# EasyEDA Pro project Schematic.epro

# Schematic Schematic
Board Name: Project; Create Date: 2025-06-19; Page Name: P1; Project Name: self_contained_light_module; Schematic Name: Schematic; Update Date: 2025-06-20; Company: EasyEDA.com; Page Size: A2; Version: V1.0
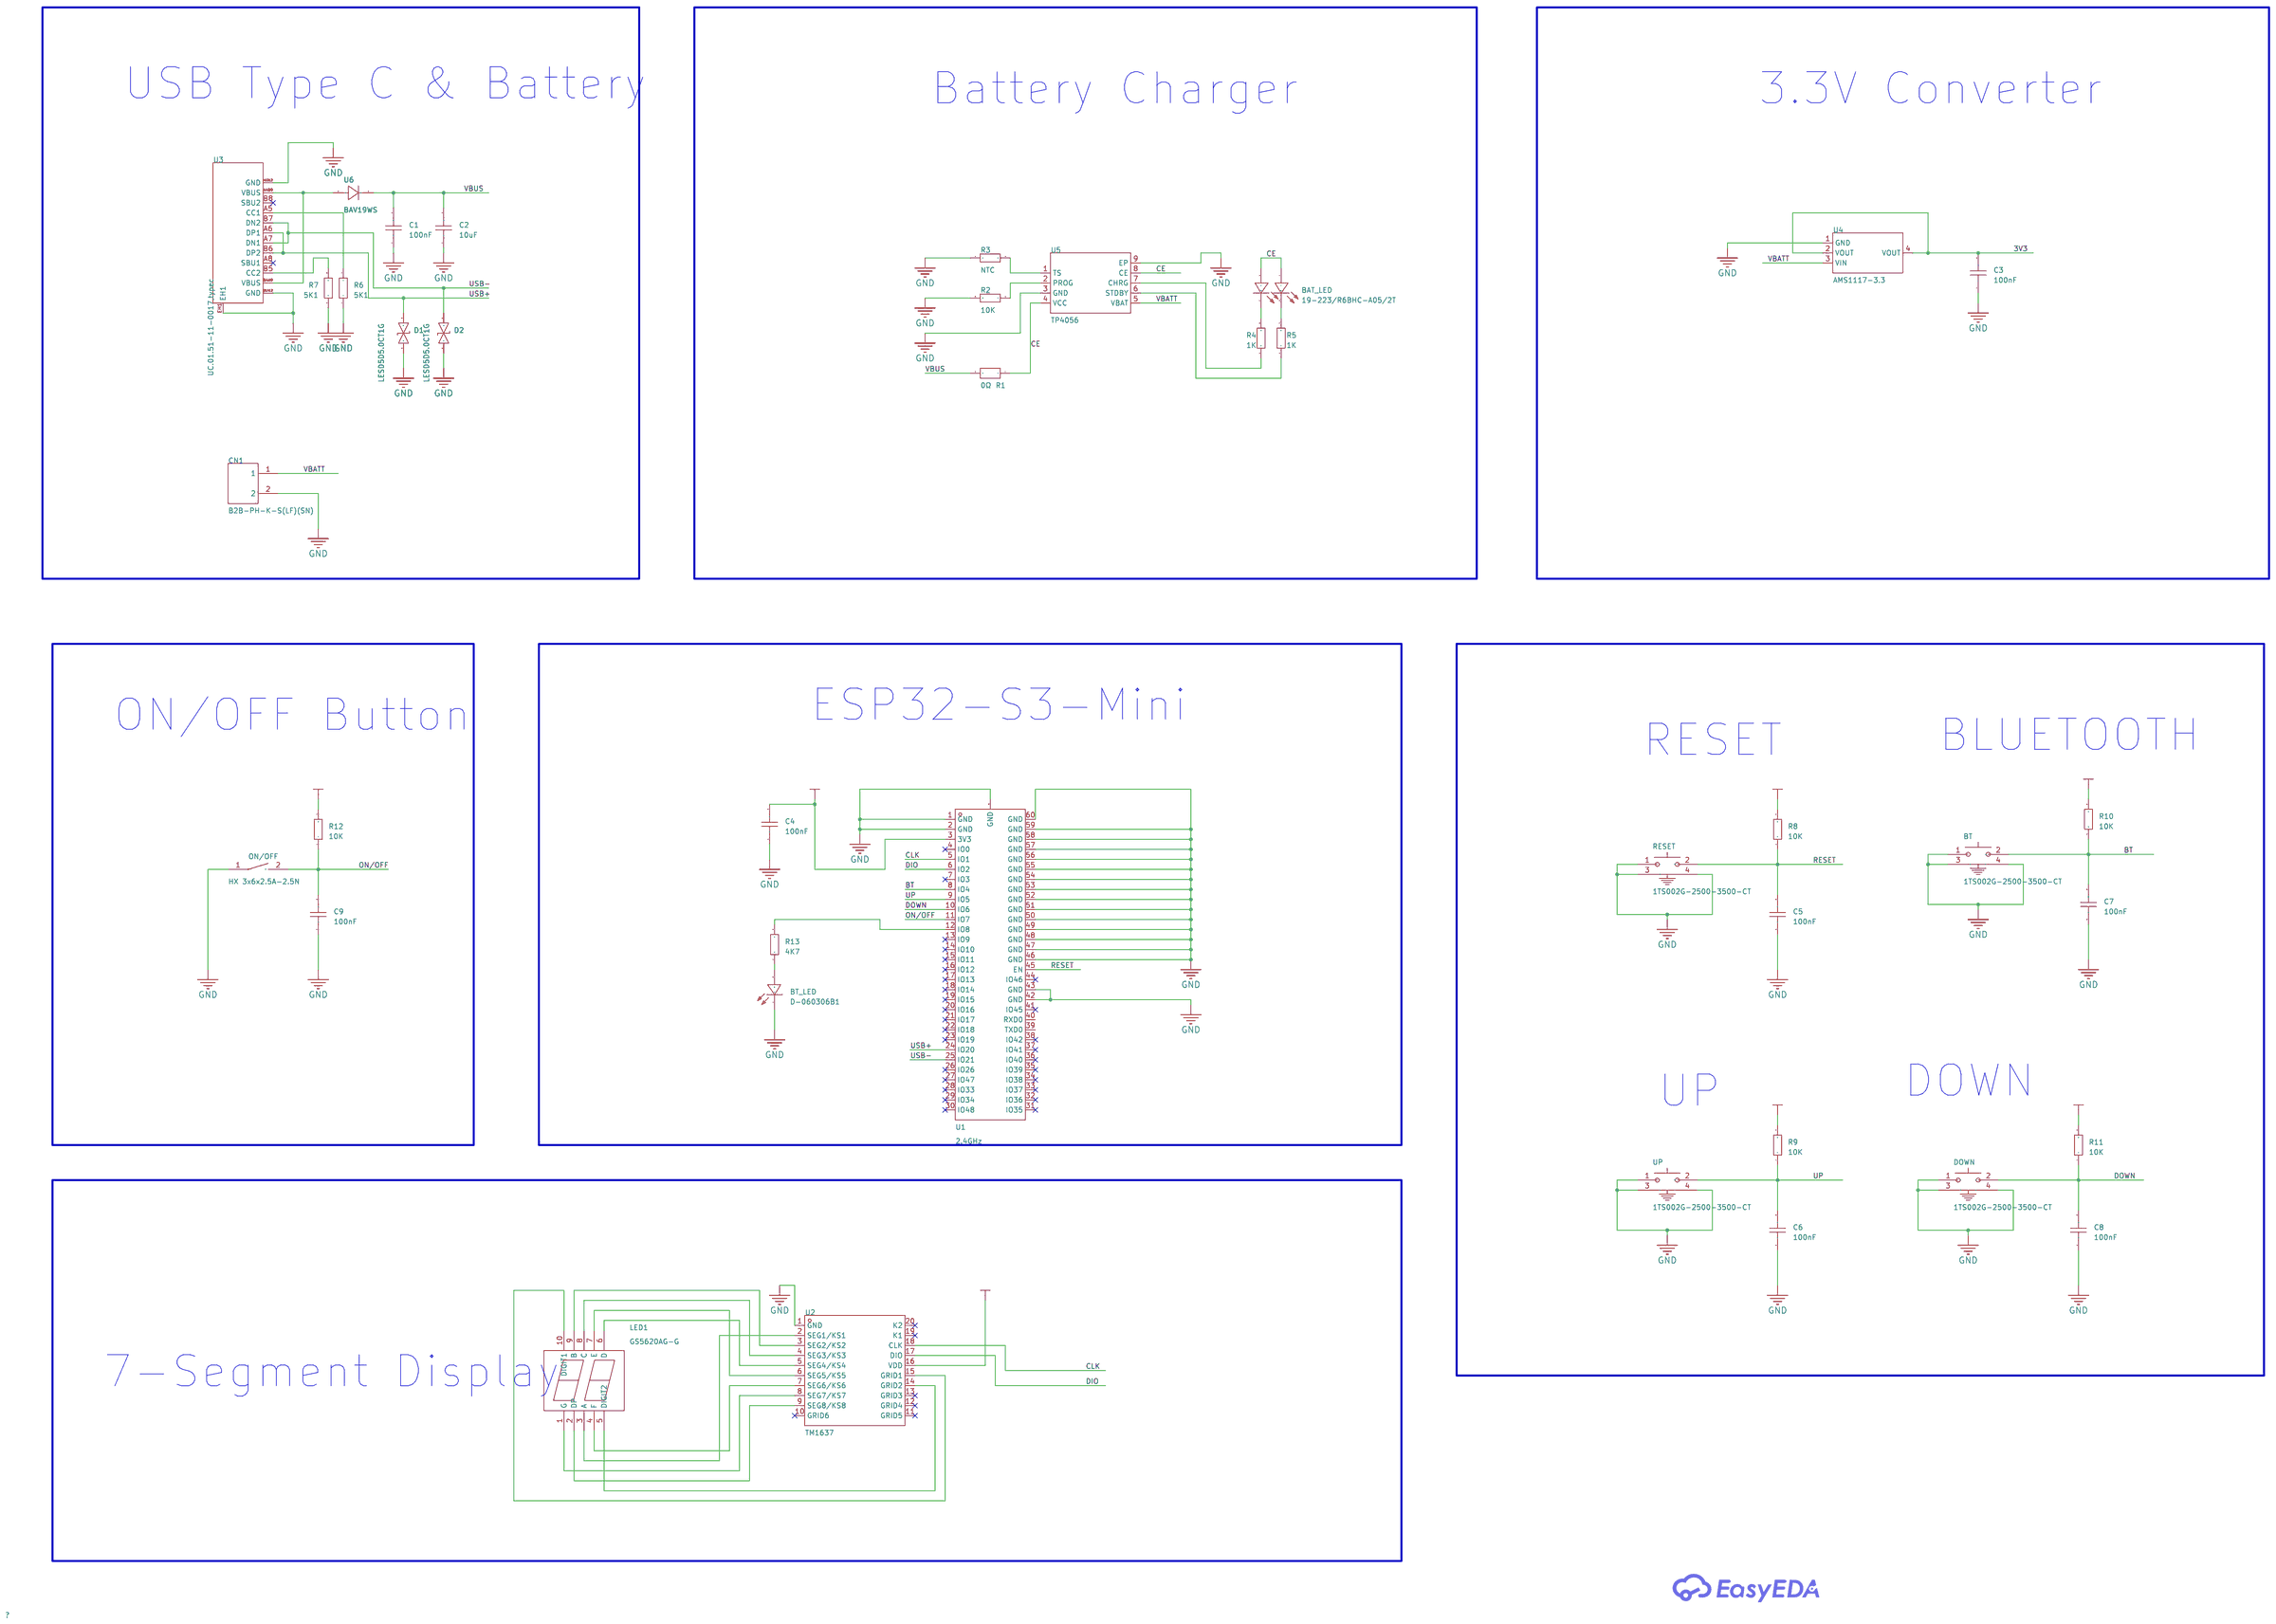
[diagram p0: schematic sheet]

## Parts
BAT_LED  19-223/R6BHC-A05/2T  [LED-ARRAY-SMD_4P-L1.6-W1.3-BR-FD]
BT  1TS002G-2500-3500-CT  [SW-SMD_1TS002G-XXXX-3500-CT]
BT_LED  D-060306B1  [LED0603-RD]
C1  100nF  [C0805]
C2  10uF  [C0805]
C3  100nF  [C0805]
C4  100nF  [C0805]
C5  100nF  [C0805]
C6  100nF  [C0805]
C7  100nF  [C0805]
C8  100nF  [C0805]
C9  100nF  [C0805]
CN1  B2B-PH-K-S(LF)(SN)  [CONN-TH_B2B-PH-K-S]
D1  LESD5D5.0CT1G  [SOD-523_L1.2-W0.8-LS1.6-BI]
D2  LESD5D5.0CT1G  [SOD-523_L1.2-W0.8-LS1.6-BI]
DOWN  1TS002G-2500-3500-CT  [SW-SMD_1TS002G-XXXX-3500-CT]
LED1  GS5620AG-G  [LED-SEG-SMD_10P-L25.1-W19.0-P2.54-S18.85-BL-1]
ON/OFF  HX 3x6x2.5A-2.5N  [SW-SMD_HX-TS-1101-C-W]
R1  0Ω  [R0603]
R2  10K  [R0603]
R3  NTC  [R0603]
R4  1K  [R0603]
R5  1K  [R0603]
R6  5K1  [R0603]
R7  5K1  [R0603]
R8  10K  [R0603]
R9  10K  [R0603]
R10  10K  [R0603]
R11  10K  [R0603]
R12  10K  [R0603]
R13  4K7  [R0603]
RESET  1TS002G-2500-3500-CT  [SW-SMD_1TS002G-XXXX-3500-CT]
U1  2.4GHz  [BULETM-SMD_ESP32-S3-MINI-1-N8]
U2  TM1637  [SOP-20_L12.8-W7.5-P1.27-LS10.4-BL]
U3  UC.01.51-11-0017,typec  [TYPE-C-SMD_UC.01.51-11-0017]
U4  AMS1117-3.3  [SOT-223-3_L6.5-W3.4-P2.30-LS7.0-BR]
U5  TP4056  [ESOP-8_L4.9-W3.9-P1.27-LS6.0-BL-EP]
U6  BAV19WS  [SOD-323_L1.8-W1.3-LS2.5-RD-1]
UP  1TS002G-2500-3500-CT  [SW-SMD_1TS002G-XXXX-3500-CT]

## Library data of the parts
BAT_LED = 19-223/R6BHC-A05/2T: Emitted Color:Red,Blue; LCSC Part Name: 红灯,蓝灯; Supplier Part: C131286; Manufacturer: EVERLIGHT(亿光); Supplier Footprint: 0603; JLCPCB Part Class: Extended Part; Datasheet: https://atta.szlcsc.com/upload/public/pdf/source/20170918/C131286_1505726896574976294.pdf; Supplier: LCSC; Emitted Color: Red,Blue
BT DOWN RESET UP = 1TS002G-2500-3500-CT: Circuit:SPST Actuator Style:Rectangle button Operating Force:250gf Mounting Style:卧贴 Switch Length:7.6mm Switch Width:3.5mm Switch Height:3.5mm Strike Gundam:不带 Contact Current:50mA Voltage Rating (DC):12V Power Rating:0.6W Insulation Resistance:100MΩ Act; LCSC Part Name: 7.6*3.5*3.5mm 卧贴 轻触开关; Supplier Part: C255804; Manufacturer: HYP(鸿源精密); Supplier Footprint: SMD,3.5x6mm; JLCPCB Part Class: Extended Part; Datasheet: https://atta.szlcsc.com/upload/public/pdf/source/20180720/C255804_9D3D4ABA82D356E51DB63A7048474151.pdf; Supplier: LCSC; Circuit: SPST; Actuator Style: Rectangle button; Operating Force: 250gf; Mounting Style: 卧贴; Switch Length: 7.6mm; Switch Width: 3.5mm; Switch Height: 3.5mm; Strike Gundam: 不带; Contact Current: 50mA; Voltage Rating (DC): 12V; Power Rating: 0.6W; Insulation Resistance: 100MΩ; Actuator/Cap Color: Black; With Lamp: No; Pin Style: J pin; Mechanical Life: 3万次; Operating Temperature: -40℃~+90℃
BT_LED = D-060306B1: Emitted Color:Blue; LCSC Part Name: 蓝灯; Supplier Part: C118339; Manufacturer: ARKLED(方舟); Supplier Footprint: 0603; JLCPCB Part Class: Extended Part; Datasheet: https://atta.szlcsc.com/upload/public/pdf/source/20190902/C118339_0F376D9FE53277D0A68A27C8339FB377.pdf; Supplier: LCSC; Emitted Color: Blue
C1 C3-C9 = CSO0805X7R104K500KT: Capacitance:100nF Tolerance:±10% Tolerance:±10% Voltage Rating:50V Temperature Coefficient:X7R; LCSC Part Name: 100nF ±10% 50V; Supplier Part: C39831405; Manufacturer: HRE(芯声); Supplier Footprint: 0805; Datasheet: https://atta.szlcsc.com/upload/public/pdf/source/20240806/98C0C648C5674F465B84244ACED515EC.pdf; Supplier: LCSC; Tolerance: ±10%; Voltage Rating: 50V; Temperature Coefficient: X7R
C2 = CL21A106KPCLQNC_1: Capacitance:10uF Tolerance:±10% Tolerance:±10% Voltage Rating:10V Temperature Coefficient:X5R; LCSC Part Name: 10uF ±10% 10V; Supplier Part: C962097; Manufacturer: SAMSUNG(三星); Manufacturer Part: CL21A106KPCLQNC; Supplier Footprint: 0805; JLCPCB Part Class: Extended Part; Datasheet: https://atta.szlcsc.com/upload/public/pdf/source/20191106/C444885_D1DE823F0ED498E02883F0194C396E9C.pdf; Supplier: LCSC; Tolerance: ±10%; Voltage Rating: 10V; Temperature Coefficient: X5R
CN1 = B2B-PH-K-S(LF)(SN): Pins Structure:1x2P Pitch:2mm Mounting Type:Direct Insert Reference Series:PH Number of Pins:2P Number of Rows:1 Number of PINs Per Row:2 Row Spacing:- Current Rating:2A Contact Material:Brass Contact Plating:Tin Operating Temperature:-25℃~+85℃ Operating; LCSC Part Name: 1x2P 间距:2mm 直插 系列:PH; Supplier Part: C131337; Manufacturer: JST; Supplier Footprint: 插件,P=2mm; JLCPCB Part Class: Extended Part; Datasheet: https://atta.szlcsc.com/upload/public/pdf/source/20171026/C131342_15089839687311058815.pdf; Supplier: LCSC; Pins Structure: 1x2P; Pitch: 2mm; Mounting Type: Direct Insert; Reference Series: PH; Number of Pins: 2P; Number of Rows: 1; Number of PINs Per Row: 2; Current Rating: 2A; Contact Material: Brass; Contact Plating: Tin; Operating Temperature: -25℃~+85℃; Voltage Rating: 100V; Plastic Material: PA66; Flame Retardant Rating: UL94V-0; Supplementary Features: K-leg punch; Color: White; Z-Height of the Board: 6mm; X-Length of Bottom Edge on Board (Spacing Line): 5.9mm; Y-Width of Bottom Edge on Board: 4.5mm
D1 D2 = LESD5D5.0CT1G: polarity:Bidirectional Reverse Stand-Off Voltage (Vrwm):5V Maximum Clamping Voltage:18.6V Peak Pulse Current (Ipp):9.4A Breakdown Voltage:5.6V Type:ESD; LCSC Part Name: 双向ESD; Supplier Part: C383211; Manufacturer: LRC(乐山无线电); Supplier Footprint: SOD-523; JLCPCB Part Class: Extended Part; Datasheet: https://atta.szlcsc.com/upload/public/pdf/source/20190807/C383211_633DF4B4E2C161403226E5235FE33A1C.pdf; Supplier: LCSC; polarity: Bidirectional; Reverse Stand-Off Voltage (Vrwm): 5V; Maximum Clamping Voltage: 18.6V; Peak Pulse Current (Ipp): 9.4A; Breakdown Voltage: 5.6V; Type: ESD
LED1 = GS5620AG-G: LCSC Part Name: LED贴片数码管; Supplier Part: C27636712; Manufacturer: Guangcai Display(光彩显示); Supplier Footprint: SMD,25.1x19mm; JLCPCB Part Class: Extended Part; Datasheet: https://atta.szlcsc.com/upload/public/pdf/source/20240709/1B1AAB2F9A15DA65FAF72B2611E1A308.pdf; Supplier: LCSC
ON/OFF = HX 3x6x2.5A-2.5N: Actuator Style:Rectangle button Operating Force:2.5N Mounting Style:Standing paste Switch Length:6mm Switch Width:3.6mm Switch Height:2.5mm Strike Gundam:- Contact Current:50mA Voltage Rating:12V Actuator/Cap Color:White With Lamp:None IP Rating:- Pin Sty; LCSC Part Name: 6*3.6*2.5mm 立贴 轻触开关; Supplier Part: C36498960; Manufacturer: hanxia(韩下); Supplier Footprint: SMD,3x6mm; JLCPCB Part Class: Extended Part; Datasheet: https://atta.szlcsc.com/upload/public/pdf/source/20241226/6D6A5CD682680470A40B0F4BC1B5337F.pdf; Supplier: LCSC; Actuator Style: Rectangle button; Operating Force: 2.5N; Mounting Style: Standing paste; Switch Length: 6mm; Switch Width: 3.6mm; Switch Height: 2.5mm; Contact Current: 50mA; Voltage Rating: 12V; Actuator/Cap Color: White; With Lamp: None; Pin Style: Gullwing; Mechanical Life: 30,000 Times; Operating Temperature: -25℃~+70℃
R1 = PT0603-R-070RL: Type:Thick Film Resistors Resistance:0Ω Tolerance:- Tolerance:- Power(Watts):; LCSC Part Name: 厚膜电阻 0Ω 100mW; Supplier Part: C2129186; Manufacturer: YAGEO(国巨); Supplier Footprint: 0603; JLCPCB Part Class: Extended Part; Datasheet: https://atta.szlcsc.com/upload/public/pdf/source/20210715/C2129186_2F95D4DB25655EF7A6A679D8DF7CA4AD.pdf; Supplier: LCSC; Type: Thick Film Resistors
R2-R13 = Res_0603: Supplier Footprint: 0603
U1 = ESP32-S3-MINI-1-N8: Core Processor:ESP32-S3FN8 Chip Wireless Standard:- Support Interface:I2C；GPIO；SPI；PWM；ADC；UART；USB；I2S Frequency:2.4GHz Antenna Type:- Output Power:20.5dBm Output Power:20.5dBm Operating Voltage:- Operating Voltage:- Receive  Current:- Send  Current:- Se; Supplier Part: C2913206; Manufacturer: ESPRESSIF(乐鑫); Supplier Footprint: SMD; JLCPCB Part Class: Extended Part; Datasheet: https://atta.szlcsc.com/upload/public/pdf/source/20220425/7F117D7A09F85946280540FD9EFDF9F3.pdf; Supplier: LCSC; Core Processor: ESP32-S3FN8 Chip; Support Interface: I2C；GPIO；SPI；PWM；ADC；UART；USB；I2S; Output Power: 20.5dBm
U2 = TM1637: Supplier Part: C2962580; Manufacturer: TM(天微); Supplier Footprint: SOP-20-300mil; JLCPCB Part Class: Extended Part; Datasheet: https://atta.szlcsc.com/upload/public/pdf/source/20140301/1457707001239.pdf; Supplier: LCSC
U3 = UC.01.51-11-0017,typec: Supplier Part: C9900066641; Supplier Footprint: usb-c-smd_type-c-6pin; JLCPCB Part Class: Extended Part; Supplier: LCSC
U4 = AMS1117-3.3_C6186: Output Type:Fixed Voltage - Supply:16V Output Voltage:3.3V Output Voltage:3.3V Output Current:1A Power Supply Rejection Ratio (PSRR):72dB@(120Hz) Voltage Dropout:1.1V@(800mA) standby current:5mA Noise:- Features:Over Current Protection；Over Temperature Pr; LCSC Part Name: 输出3.3V 1A; Supplier Part: C6186; Manufacturer: AMS; Supplier Footprint: SOT-223; JLCPCB Part Class: Basic Part; Datasheet: https://atta.szlcsc.com/upload/public/pdf/source/20180727/C6186_7A095716F0823C02F1997A905E26C086.pdf; Supplier: LCSC; Output Type: Fixed; Voltage - Supply: 16V; Output Voltage: 3.3V; Output Current: 1A; Power Supply Rejection Ratio (PSRR): 72dB@(120Hz); Voltage Dropout: 1.1V@(800mA); standby current: 5mA; Features: Over Current Protection；Over Temperature Protection; Operating Temperature: -40℃~+125℃; Output Configuration: Positive; Number of Outputs: 1
U5 = TP4056_C22470410: The Chip Type:Linear charging chip Voltage - Supply:4.5V~5.5V Voltage - Supply:4.5V~5.5V Charge Current - Max:1000mA Charging Saturation Voltage:4.2V End-Off Voltage:- Type of Battery:Lithium-ion/Polymer Number of Cells:1 Number of Cells:1 Operating Tempe; Supplier Part: C22470410; Manufacturer: JSMSEMI(杰盛微); Supplier Footprint: ESOP-8; JLCPCB Part Class: Extended Part; Datasheet: https://atta.szlcsc.com/upload/public/pdf/source/20240625/CEC2C0E539B944633666A6FB842D3E54.pdf; Supplier: LCSC; The Chip Type: Linear charging chip; Voltage - Supply: 4.5V~5.5V; Charge Current - Max: 1000mA; Charging Saturation Voltage: 4.2V; Type of Battery: Lithium-ion/Polymer; Number of Cells: 1; Operating Temperature: -40℃~+85℃
U6 = BAV19WS_C5805720: Voltage - Forward(Vf@If):1.25V@200mA Voltage - DC Reverse(Vr): Current - Rectified: Reverse Recovery Time (trr):; Supplier Part: C5805720; Manufacturer: XZT(信展通); Supplier Footprint: SOD-323; JLCPCB Part Class: Extended Part; Datasheet: https://atta.szlcsc.com/upload/public/pdf/source/20230629/E4E85EFD91591638FF0AFD85D4A0C7B6.pdf; Supplier: LCSC; Voltage - Forward(Vf@If): 1.25V@200mA

## Nets
3V3: C3.2 C4.2 R8.2 R9.2 R10.2 R11.2 R12.2 U1.3(3V3) U4.2(VOUT) U4.4(VOUT)
GND: BT.1 BT.3 BT.4 BT_LED.1 C1.1 C2.1 C3.1 C4.1 C5.1 C6.1 C7.1 C8.1 C9.1 CN1.2 D1.1 D2.1 DOWN.1 DOWN.3 DOWN.4 ON/OFF.1 R2.2 R3.1 R6.1 R7.1 RESET.1 RESET.3 RESET.4 U1.1(GND) U1.2(GND) U1.42(GND) U1.43(GND) U1.46(GND) U1.47(GND) U1.48(GND) U1.49(GND) U1.50(GND) U1.51(GND) U1.52(GND) U1.53(GND) U1.54(GND) U1.55(GND) U1.56(GND) U1.57(GND) U1.58(GND) U1.59(GND) U1.60(GND) U1.GND U2.1(GND) U3.A1B12(GND) U3.B1A12(GND) U3.EH1 U4.1(GND) U5.3(GND) U5.9(EP) UP.1 UP.3 UP.4
VBATT: CN1.1 U2.16(VDD) U4.3(VIN) U5.5(VBAT)
VBUS: C1.2 C2.2 R1.2 U6.1(K)
BT: BT.2 C7.2 R10.1 U1.8(IO4)
CE: BAT_LED.1(A) BAT_LED.3(A) R1.1 U5.4(VCC) U5.8(CE)
CLK: U1.5(IO1) U2.18(CLK)
DIO: U1.6(IO2) U2.17(DIO)
DOWN: C8.2 DOWN.2 R11.1 U1.10(IO6)
ON/OFF: C9.2 ON/OFF.2 R12.1 U1.11(IO7)
RESET: C5.2 R8.1 RESET.2 U1.45(EN)
UP: C6.2 R9.1 U1.9(IO5) UP.2
USB+: D1.2 U1.24(IO20) U3.A6(DP1) U3.B6(DP2)
USB-: D2.2 U1.25(IO21) U3.A7(DN1) U3.B7(DN2)
Net-(BAT_LED-2): BAT_LED.2(C) R5.2
Net-(BAT_LED-4): BAT_LED.4(C) R4.2
Net-(BT_LED-2): BT_LED.2 R13.1
Net-(LED1-1): LED1.1(G) U2.8(SEG7/KS7)
Net-(LED1-2): LED1.2(DP) U2.9(SEG8/KS8)
Net-(LED1-3): LED1.3(A) U2.2(SEG1/KS1)
Net-(LED1-4): LED1.4(F) U2.7(SEG6/KS6)
Net-(LED1-5): LED1.5(DIGIT2) U2.14(GRID2)
Net-(LED1-6): LED1.6(D) U2.5(SEG4/KS4)
Net-(LED1-7): LED1.7(E) U2.6(SEG5/KS5)
Net-(LED1-8): LED1.8(C) U2.4(SEG3/KS3)
Net-(LED1-9): LED1.9(B) U2.3(SEG2/KS2)
Net-(LED1-10): LED1.10(DIGIT1) U2.15(GRID1)
Net-(R2-1): R2.1 U5.2(PROG)
Net-(R3-2): R3.2 U5.1(TS)
Net-(R4-1): R4.1 U5.7(CHRG)
Net-(R5-1): R5.1 U5.6(STDBY)
Net-(R6-2): R6.2 U3.A5(CC1)
Net-(R7-2): R7.2 U3.B5(CC2)
Net-(R13-2): R13.2 U1.12(IO8)
Net-(U3-A4B9): U3.A4B9(VBUS) U3.B4A9(VBUS) U6.2(A)

Not connected (* = marked no-connect by the designer): U1 4(IO0)* 7(IO3)* 13(IO9)* 14(IO10)* 15(IO11)* 16(IO12)* 17(IO13)* 18(IO14)* 19(IO15)* 20(IO16)* 21(IO17)* 22(IO18)* 23(IO19)* 26(IO26)* 27(IO47)* 28(IO33)* 29(IO34)* 30(IO48)* 31(IO35)* 32(IO36)* 33(IO37)* 34(IO38)* 35(IO39)* 36(IO40)* 37(IO41)* 38(IO42)* 39(TXD0) 40(RXD0) 41(IO45)* 44(IO46)*; U2 10(GRID6)* 11(GRID5)* 12(GRID4)* 13(GRID3)* 19(K1)* 20(K2)*; U3 A8(SBU1)* B8(SBU2)*

## Notes on the sheet
- USB Type C & Battery
- Battery Charger
- 3.3V Converter
- ON/OFF Button
- ESP32-S3-Mini
- BLUETOOTH
- RESET
- DOWN
- UP
- 7-Segment Display
